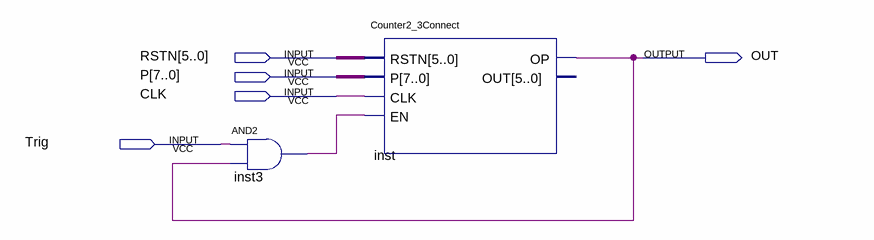
[diagram p0: schematic sheet]
// Quartus schematic Cutoff.bdf as structural Verilog: 2 symbols, 5 pins
module Cutoff (
  input  [5:0] RSTN,
  input  [7:0] P,
  input  CLK,
  input  Trig,
  output OUT
);

  wire inst3_out;

  and inst3 (inst3_out, Trig, OUT);
  Counter2_3Connect inst (.RSTN(RSTN), .P(P), .CLK(CLK), .EN(inst3_out), .OP(OUT));  // open: OUT
endmodule
